# EAGLE schematic CAN Tester rev1 (EAGLE 9.1.3)
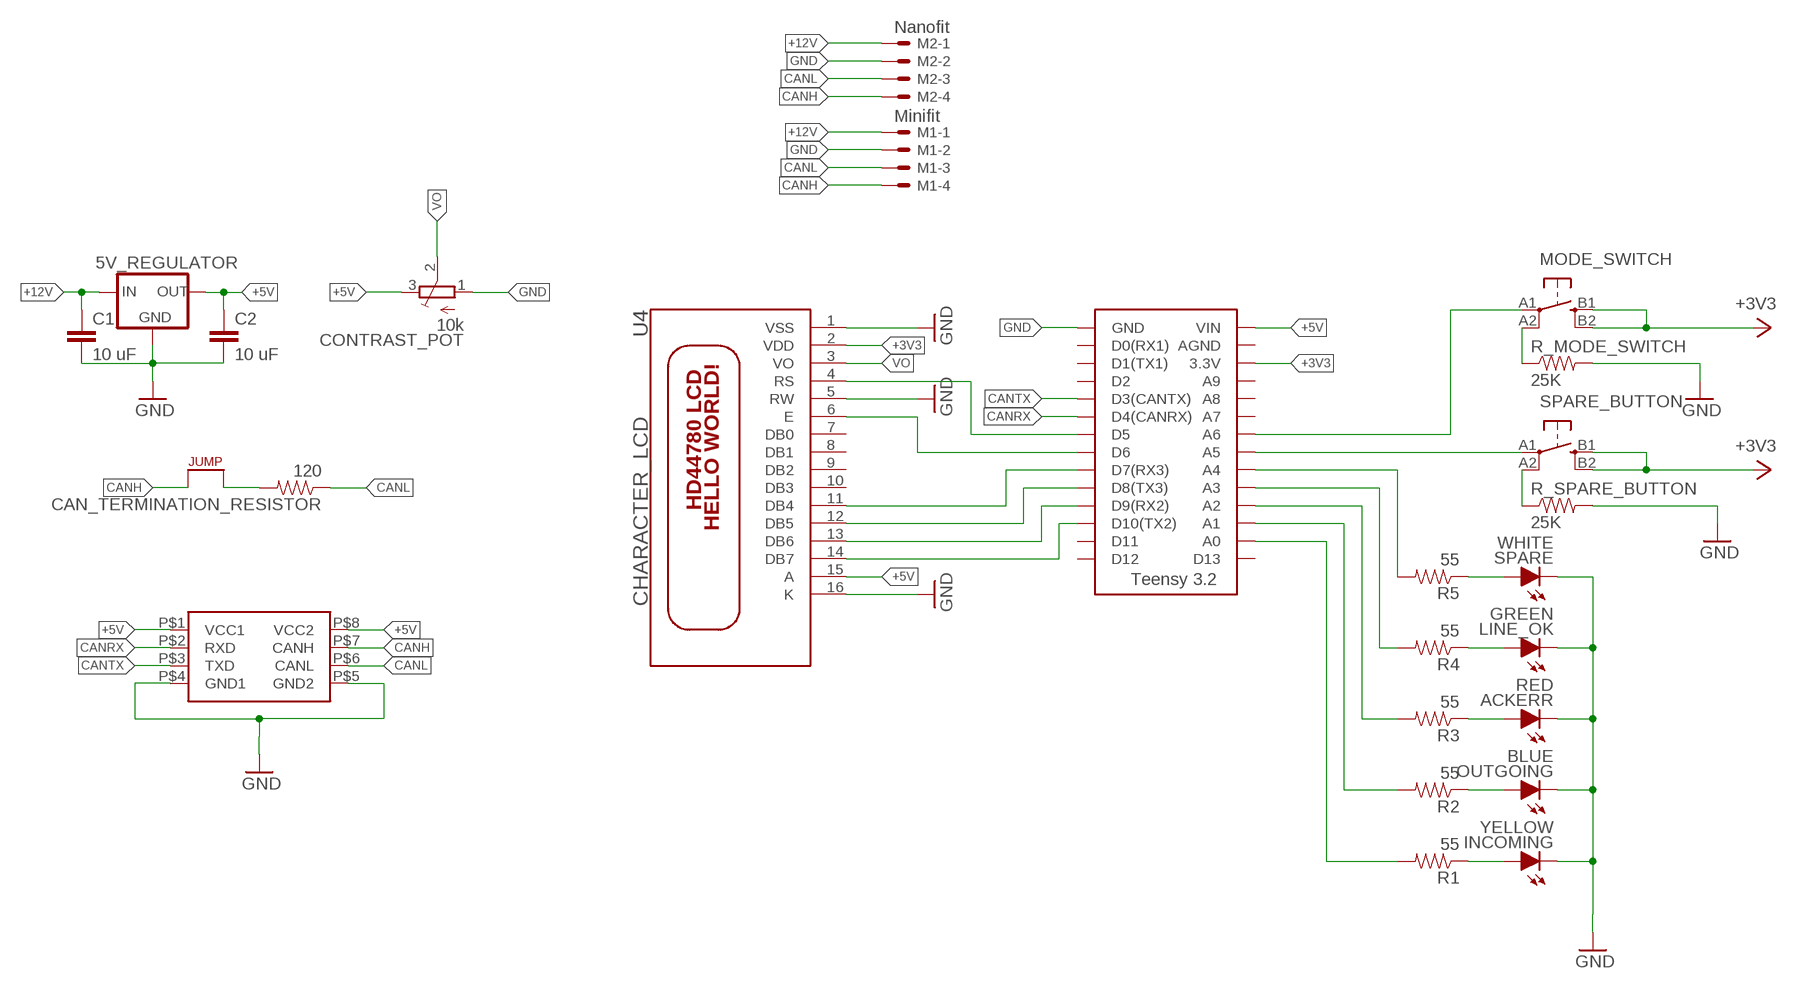
[diagram p0: schematic, sheet 1]

## Parts
5V_REGULATOR  5VREG_LM340-NLM340MPX-5.0/NOPB  [SOT223]
ACKERR  RED  LED-0805  [LED-805]
C1  10 uF  CAP0805  [0805]
C2  10 uF  CAP0805  [0805]
CAN_TERMINATION_RESISTOR  120  RESISTOR0805-RES  [0805]
CONTRAST_POT  10k  TRIMPOT3386  [TRIM-3386]
INCOMING  YELLOW  LED-0805  [LED-805]
LINE_OK  GREEN  LED-0805  [LED-805]
M1  Minifit  CONNECTOR-4DURACLIK_RIGHT_ANGLE-4  [DURACLIK_RIGHT_ANGLE-4]
M2  Nanofit  CONNECTOR-4NANO-FIT_RIGHT_ANGLE-4-SURFACE  [NANO-FIT_RIGHT_ANGLE-4-SURFACE]
MODE_SWITCH  BTN_10-XXSMD  [TACTILE_SWITCH_SMD_6.2MM_TALL]
OUTGOING  BLUE  LED-0805  [LED-805]
R1  55  RESISTOR0805-RES  [0805]
R2  55  RESISTOR0805-RES  [0805]
R3  55  RESISTOR0805-RES  [0805]
R4  55  RESISTOR0805-RES  [0805]
R5  55  RESISTOR0805-RES  [0805]
R_MODE_SWITCH  25K  RESISTOR0805-RES  [0805]
R_SPARE_BUTTON  25K  RESISTOR0805-RES  [0805]
SPARE  WHITE  LED-0805  [LED-805]
SPARE_BUTTON  BTN_10-XXSMD  [TACTILE_SWITCH_SMD_6.2MM_TALL]
U1  ISOLATED CAN TERMINAL  ISO1050CAN  [DUB8]
U2  TERMINATION_RESISTOR_JUMPER  JUMPER  [0805]
U3  TEENSY_3.2_SIMPLE  [TEENSY_3.2_SIMPLE]
U4  CHARACTER_LCD  HD44780LCD-1602  [LCD1602]

## Nets
+3V3: MODE_SWITCH.B1(S) MODE_SWITCH.B2(S1) SPARE_BUTTON.B1(S) SPARE_BUTTON.B2(S1) U3.3.3V U4.2(VDD)
+5V: 5V_REGULATOR.3(OUT) C2.1 CONTRAST_POT.3(E) U1.P$1(VCC1) U1.P$8(VCC2) U3.VIN U4.15(A)
+12V: 5V_REGULATOR.1(IN) C1.1 M1.1 M2.1
CANH: M1.4 M2.4 U1.P$7(CANH) U2.1
CANL: CAN_TERMINATION_RESISTOR.1 CAN_TERMINATION_RESISTOR.2 M1.3 M2.3 U1.P$6(CANL) U2.2
CANRX: U1.P$2(RXD) U3.D4(CANRX)
CANTX: U1.P$3(TXD) U3.D3(CANTX)
GND: 5V_REGULATOR.2(GND) 5V_REGULATOR.4(GND) ACKERR.C C1.2 C2.2 CONTRAST_POT.1(A) INCOMING.C LINE_OK.C M1.2 M2.2 OUTGOING.C R_SPARE_BUTTON.2 SPARE.C U3.GND U4.5(RW) U4.16(K)
N$1: R1.2 U3.A0
N$2: R5.1 SPARE.A
N$3: SPARE_BUTTON.A1(P) U3.A5
N$4: R2.2 U3.A1
N$5: R3.2 U3.A2
N$6: R4.2 U3.A3
N$7: R5.2 U3.A4
N$8: LINE_OK.A R4.1
N$9: ACKERR.A R3.1
N$10: OUTGOING.A R2.1
N$11: INCOMING.A R1.1
N$12: R_SPARE_BUTTON.1 SPARE_BUTTON.A2(P1)
N$13: MODE_SWITCH.A1(P) U3.A6
N$14: MODE_SWITCH.A2(P1) R_MODE_SWITCH.1
N$15: R_MODE_SWITCH.2
N$16: U1.P$4(GND1) U1.P$5(GND2)
N$17: U3.D5 U4.4(RS)
N$18: U3.D6 U4.6(E)
N$19: U3.D7(RX3) U4.11(DB4)
N$20: U3.D8(TX3) U4.12(DB5)
N$21: U3.D9(RX2) U4.13(DB6)
N$22: U3.D10(TX2) U4.14(DB7)
VO: CONTRAST_POT.2(S) U4.3(VO)
VSS: U4.1(VSS) ; supply symbol labelled GND
Unconnected: U3.A7 U3.A8 U3.A9 U3.AGND U3.D0(RX1) U3.D1(TX1) U3.D2 U3.D11 U3.D12 U3.D13 U4.7(DB0) U4.8(DB1) U4.9(DB2) U4.10(DB3)

## Library data of the parts
5V_REGULATOR = HyTechDevices:5VREG_LM340-N: Voltage Regulator 5v linear voltage regulator Datasheet <http://www.mouser.com/ProductDetail/Texas-Instruments/LM340MPX-50-NOPB/?qs=X1J7HmVL2ZGZwtTFRQ9ItA%3D%3D> MAX current out: 1.5A MAX voltage in: 35V
ACKERR INCOMING LINE_OK OUTGOING SPARE = HyTechDevices:LED: Light Emitting Diode (LED) Source: Dangerous Prototypes Eagle Library <https://github.com/DangerousPrototypes/Eagle_Part_Library>
C1 C2 = HyTechDevices:CAP: Capacitor Standard 0603 ceramic capacitor, and 0.1" leaded capacitor.
CAN_TERMINATION_RESISTOR R1-R5 R_MODE_SWITCH R_SPARE_BUTTON = HyTechDevices:RESISTOR: Resistor Basic schematic elements and footprints for 0603, 1206, and PTH resistors.
CONTRAST_POT = HyTechDevices:TRIMPOT: SMT trimmer potentiometer part number TC33X http://www.ladyada.net/library/eagle
M1 M2 = HyTechDevices:CONNECTOR-4: Mini-Fit Junior connector 4 pole Source: http://www.molex.com
MODE_SWITCH SPARE_BUTTON = HyTechDevices:BTN_10-XX: Small momentary tactile push button
U1 = HyTechDevices:ISO1050CAN
U2 = HyTechDevices:JUMPER: Jumper for changing operation of a device
U3 = HyTechDevices:TEENSY_3.2_SIMPLE: Simple version of the Teensy 3.2 board that only uses the 2 main rows of pins, not the inner pins or the pins opposite the usb port.
U4 = HyTechDevices:HD44780LCD: HD44780 LCD Standard character type LCDs, available in sizes from 8x1 to 40x4!